# Altium project PROC154E3_SCH.PrjPcb (part 51 of 60)

## Sheet 54. SOC CORE HCPS-B.SchDoc: HCPS B - VDD CORE
size 513 x 386 mm; Project: PROC154E2(001)_SK_AM69; Issue: 1.0; RevCode: E3; Page Create Date: March  8, 1995; Variant Name: Core Design; Schematic Page Number: 54; Page Number: 54; Page Size: C; Comment: MISTRAL_TITLEBLK_CSIZE_1; Page Count: 62; Schematic Page Count: 62; Name: PROC154E2 001 SK AM69; DsnPath: C:\Users\danie\Downloads\sprr466c\PROC154E3_RP\PROC154E3_SCH.DSN; SchematicName: SCHEMATIC1; PageName: 54. SOC CORE HCPS-B; PageSize: C; TopSchematic: True
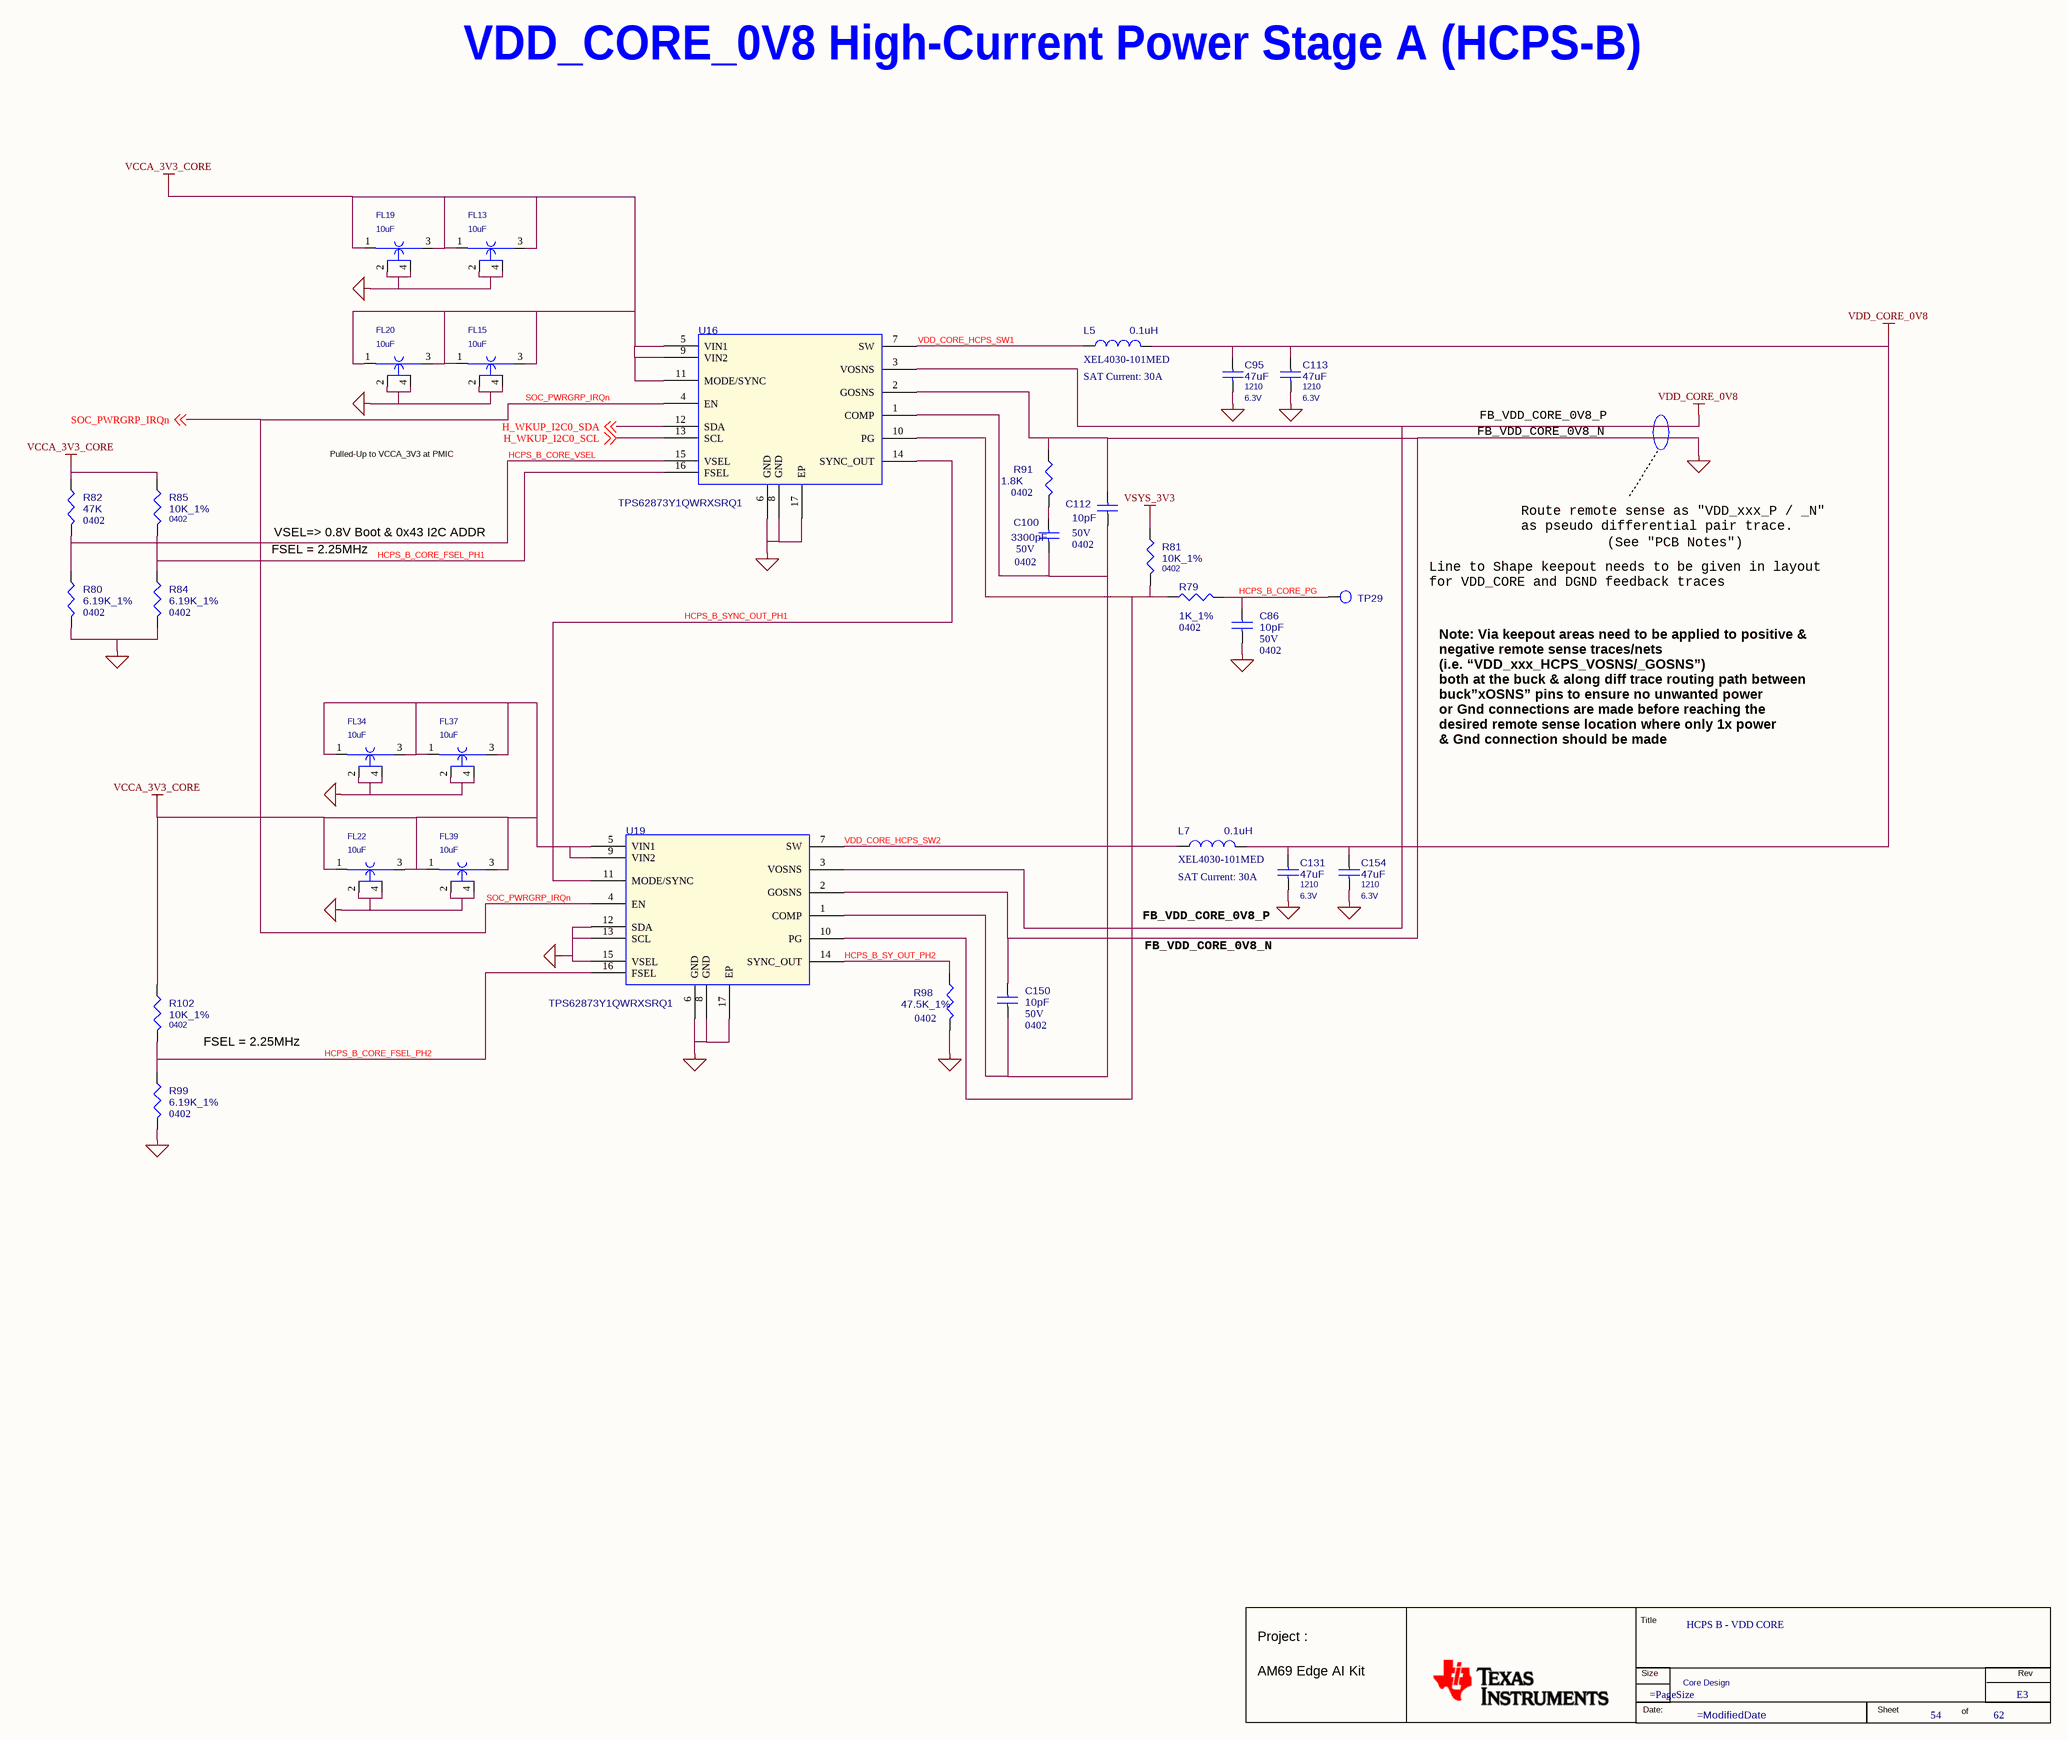
[diagram p91: 54. SOC CORE HCPS-B.SchDoc]

### Parts
(Parts that share a designator on the sheet are numbered #1, #2 ... from top to bottom, then left to right.)
*#54  RevCode: E3  Title: HCPS B - VDD CORE  Page Number: 54  Page Count: 62  Variant Name: Core Design  (hidden comment: MISTRAL_TITLEBLK_CSIZE_1)  (graphical)
C86  10pF  Package: 0402  Voltage: 50V  [CAP0402_0-75]
C95  47uF  Package: 1210  Voltage: 6.3V  [CAP1210_2-75]
C100  3300pF  Package: 0402  Voltage: 50V  [CAP0402_0-75]
C112  10pF  Package: 0402  Voltage: 50V  [CAP0402_0-75]
C113  47uF  Package: 1210  Voltage: 6.3V  [CAP1210_2-75]
C131  47uF  Package: 1210  Voltage: 6.3V  [CAP1210_2-75]
C150  10pF  Package: 0402  Voltage: 50V  [CAP0402_0-75]
C154  47uF  Package: 1210  Voltage: 6.3V  [CAP1210_2-75]
FL13  10uF  [EMIFIL_NFM18C_0603_0-7_TI]
FL15  10uF  [EMIFIL_NFM18C_0603_0-7_TI]
FL19  10uF  [EMIFIL_NFM18C_0603_0-7_TI]
FL20  10uF  [EMIFIL_NFM18C_0603_0-7_TI]
FL22  10uF  [EMIFIL_NFM18C_0603_0-7_TI]
FL34  10uF  [EMIFIL_NFM18C_0603_0-7_TI]
FL37  10uF  [EMIFIL_NFM18C_0603_0-7_TI]
FL39  10uF  [EMIFIL_NFM18C_0603_0-7_TI]
L5  0.1uH  Mfr_part_number: XEL4030-101MED  SAT Current: 30A  [IND_XEL4030_170X170_SMD_3-2]
L7  0.1uH  Mfr_part_number: XEL4030-101MED  SAT Current: 30A  [IND_XEL4030_170X170_SMD_3-2]
R79  1K_1%  Package: 0402  [RES0402_0-5]
R80  6.19K_1%  Package: 0402  [RES0402_0-5]
R81  10K_1%  Package: 0402  [RES0402_0-5]
R82  47K  Package: 0402  [RES0402_0-5]
R84  6.19K_1%  Package: 0402  [RES0402_0-5]
R85  10K_1%  Package: 0402  [RES0402_0-5]
R91  1.8K  Package: 0402  [RES0402_0-5]
R98  47.5K_1%  Package: 0402  [RES0402_0-5]
R99  6.19K_1%  Package: 0402  [RES0402_0-5]
R102  10K_1%  Package: 0402  [RES0402_0-5]
TP29  TP30_SMD  [TP30_SMD]  (value not drawn)
U16  TPS62873Y1QWRXSRQ1  [VQFN16_TPS62872-Q1_100X140_1-1]
U19  TPS62873Y1QWRXSRQ1  [VQFN16_TPS62872-Q1_100X140_1-1]

### Nets
DGND: C86.2 C95.2 C112.1 C113.2 C131.2 C150.1 C154.2 FL13.2 FL13.4 FL15.2 FL15.4 FL19.2 FL19.4 FL20.2 FL20.4 FL22.2 FL22.4 FL34.2 FL34.4 FL37.2 FL37.4 FL39.2 FL39.4 R80.2 R84.2 R91.1 R98.2 R99.2 U16.2(GOSNS) U16.6(GND) U16.8(GND) U16.17(EP) U19.2(GOSNS) U19.6(GND) U19.8(GND) U19.12(SDA) U19.13(SCL) U19.15(VSEL) U19.17(EP)  [project net VDD_CPU_HCPS_GOSNS]
VCCA_3V3_CORE: FL13.1 FL13.3 FL15.1 FL15.3 FL19.1 FL19.3 FL20.1 FL20.3 FL22.1 FL22.3 FL34.1 FL34.3 FL37.1 FL37.3 FL39.1 FL39.3 R82.1 R85.1 R102.1 U16.5(VIN1) U16.9(VIN2) U16.11(MODE/SYNC) U19.5(VIN1) U19.9(VIN2)
VDD_CORE_0V8: C95.1 C113.1 C131.1 C154.1 L5.2 L7.2 U16.3(VOSNS) U19.3(VOSNS)  [project net VDD_WAKE0]
VSYS_3V3: R81.1  [project net V_3V3]
H_WKUP_I2C0_SCL: U16.13(SCL) ; off-sheet H_WKUP_I2C0_SCL
H_WKUP_I2C0_SDA: U16.12(SDA) ; off-sheet H_WKUP_I2C0_SDA
HCPS_B_CORE_FSEL_PH1: R84.1 R85.2 U16.16(FSEL)
HCPS_B_CORE_FSEL_PH2: R99.1 R102.2 U19.16(FSEL)
HCPS_B_CORE_PG: C86.1 R79.2 TP29.1(TP)
HCPS_B_CORE_VSEL: R80.1 R82.2 U16.15(VSEL)
HCPS_B_SY_OUT_PH2: R98.1 U19.14(SYNC_OUT)
HCPS_B_SYNC_OUT_PH1: U16.14(SYNC_OUT) U19.11(MODE/SYNC)
SOC_PWRGRP_IRQn: U16.4(EN) U19.4(EN) ; off-sheet SOC_PWRGRP_IRQn
VDD_CORE_HCPS_SW1: L5.1 U16.7(SW)
VDD_CORE_HCPS_SW2: L7.1 U19.7(SW)
NetC100_1: C100.1 R91.2
NetC100_2: C100.2 C112.2 C150.2 U16.1(COMP) U19.1(COMP)
NetR79_1: R79.1 R81.2 U16.10(PG) U19.10(PG)

### Notes on the sheet
- VDD_CORE_0V8 High-Current Power Stage A (HCPS-B)
- FB_VDD_CORE_0V8_N
- FB_VDD_CORE_0V8_P
- Pulled-Up to VCCA_3V3 at PMIC
- VSEL=> 0.8V Boot & 0x43 I2C ADDR
- Route remote sense as "VDD_xxx_P / _N"
  as pseudo differential pair trace.
- (See "PCB Notes")
- FSEL = 2.25MHz
- Line to Shape keepout needs to be given in layout
  for VDD_CORE and DGND feedback traces
- Note: Via keepout areas need to be applied to positive &
  negative remote sense traces/nets
  (i.e. “VDD_xxx_HCPS_VOSNS/_GOSNS”)
  both at the buck & along diff trace routing path between
  buck”xOSNS” pins to ensure no unwanted power
  or Gnd connections are made before reaching the
  desired remote sense location where only 1x power
  & Gnd connection should be made
- (in symbol MISTRAL_TITLEBLK_CSIZE_1) Title; Project :; Size; Rev; AM69 Edge AI Kit; Date:; Sheet; of

### Library data of the parts
*#54 = MISTRAL_TITLEBLK_CSIZE_1: Issue: 1.0; Project: PROC154E2(001)_SK_AM69; Name: PROC154E2 001 SK AM69; Page Create Date: March  8, 1995; Page Size: =PageSize; Page Modify Date: =ModifiedDate; Schematic Page Count: 62; Schematic Page Number: 54
C86 = CAP_Dup1: CAP CERAMIC 10pF 50V 1% C0G(NP0) 0402; Part Reference: C86; Automotive Alternate_mfr_part_number: CGA2B1X7R1C104K050BC; Automotive Alternate_mfr_name: TDK; Direct Alternate_mfr_part_number: GCM155R71C104JA55D; Direct Alternate_mfr_name: MURATA; Part_type: CAPACITORS\CERAMIC; Mfr_part_number: 04025U100FAT2A; Mfr_name: AVX CORPORATION; Mistral Part No: 120014060010-R; Custom_Duty: 15%; Customs_HS_Code: 85322990; Wattage: NA; Project: AEGIS_POM; Value: 10pF; Footprint Path: Y:\MIS_DATABASE\Library\ALTIUM_TOOL\PCB_FOOTPRINTS\Altium_Footprint_Lib.PcbLib; Library Path: Y:\MIS_DATABASE\Library\ALTIUM_TOOL\SCHEMATICS_PARTS\MS_DISCRETE_Library.schlib; MECHANICAL 3D STEP FILE: CAP0402_0-75; Chkd/date: VASANTHA/200614; Crtd /date: NAVEED/170614; Datasheet: Y:\MIS_DATABASE\DATASHEETS\CAPACITORS\AVX_MLC.PDF; Temperature: -55°C+125°C; Weight: 0.65mg; Height: 0.55MM; Library Ref: CAP; Distributor_part_number: 478-5717-1-ND; Distributor_name: DIGIKEY; Tolerance: 1%; Footprint Ref: CAP0402_0-75; Manufacturer: AVX CORPORATION; PCB Footprint: CAP0402_0-75
C95 = CAP_Dup1: CAP CERAMIC 47uF 6.3V 10% X7R AUTO 1210; Part Reference: C95; Automotive Alternate_mfr_part_number: CGA6P1X7S1A476M; Automotive Alternate_mfr_name: TDK; Part_type: CAPACITORS\CERAMIC; Mfr_part_number: GCM32ER70J476KE19L; Mfr_name: MURATA; Mistral Part No: 120018090056-R; Custom_Duty: 15%; Customs_HS_Code: 85322990; Wattage: NA; Project: TI_J7_SVB-DUT; Value: 47uF; Direct Alternate_mfr_part_number: CGA6P1X7S1A476M; Direct Alternate_mfr_name: TDK; Footprint Path: Y:\MIS_DATABASE\Library\ALTIUM_TOOL\PCB_FOOTPRINTS\Altium_Footprint_Lib.PcbLib; Library Path: Y:\MIS_DATABASE\Library\ALTIUM_TOOL\SCHEMATICS_PARTS\MS_DISCRETE_Library.schlib; MECHANICAL 3D STEP FILE: CAP1210_2-75; Chkd/date: MANIRAJA/280918; Crtd /date: ALVY/280918; Datasheet: Y:\MIS_DATABASE\DATASHEETS\CAPACITORS\MURATA-GCM-SER.PDF; Temperature: -55°C+125°C; Weight: 110mg; Height: 2.70MM; Library Ref: CAP; Distributor_part_number: 490-4844-1-ND; Distributor_name: DIGIKEY; Tolerance: 10%; Footprint Ref: CAP1210_2-75; Manufacturer: MURATA; PCB Footprint: CAP1210_2-75
C100 = CAP_Dup1: CAP CERAMIC 3300pF 50V 10% X7R 0402; Part Reference: C100; Automotive Alternate_mfr_part_number: CGA2B1X7R1C104K050BC; Automotive Alternate_mfr_name: TDK; Direct Alternate_mfr_part_number: GCM155R71C104JA55D; Direct Alternate_mfr_name: MURATA; Part_type: CAPACITORS\CERAMIC; Mfr_part_number: GCM155R71H332KA37D; Mistral Part No: 120022080077-R; Custom_Duty: 15%; Customs_HS_Code: 85322990; Wattage: NA; Project: BRUKER_SD820_COMMONDO; Value: 3300pF; Footprint Path: Y:\MIS_DATABASE\Library\ALTIUM_TOOL\PCB_FOOTPRINTS\Altium_Footprint_Lib.PcbLib; Library Path: Y:\MIS_DATABASE\Library\ALTIUM_TOOL\SCHEMATICS_PARTS\MS_DISCRETE_Library.schlib; MECHANICAL 3D STEP FILE: CAP0402_0-75; Chkd/date: PRAVEEN/300822; Crtd /date: PRAVEEN/300822; Datasheet: Y:\MIS_DATABASE\DATASHEETS\CAPACITORS\GCM155R71H332KA37D.PDF; Temperature: -55°C+125°C; Weight: 1.6mg; Height: 0.55MM; Library Ref: CAP; Distributor_part_number: 490-8001-1-ND; Distributor_name: DIGIKEY; Tolerance: 10%; Mfr_name: MURATA; Footprint Ref: CAP0402_0-75; Manufacturer: MURATA; PCB Footprint: CAP0402_0-75
C112 = CAP_Dup1: CAP CERAMIC 10pF 50V 1% C0G(NP0) 0402; Part Reference: C112; Automotive Alternate_mfr_part_number: CGA2B1X7R1C104K050BC; Automotive Alternate_mfr_name: TDK; Direct Alternate_mfr_part_number: GCM155R71C104JA55D; Direct Alternate_mfr_name: MURATA; Part_type: CAPACITORS\CERAMIC; Mfr_part_number: 04025U100FAT2A; Mfr_name: AVX CORPORATION; Mistral Part No: 120014060010-R; Custom_Duty: 15%; Customs_HS_Code: 85322990; Wattage: NA; Project: AEGIS_POM; Value: 10pF; Footprint Path: Y:\MIS_DATABASE\Library\ALTIUM_TOOL\PCB_FOOTPRINTS\Altium_Footprint_Lib.PcbLib; Library Path: Y:\MIS_DATABASE\Library\ALTIUM_TOOL\SCHEMATICS_PARTS\MS_DISCRETE_Library.schlib; MECHANICAL 3D STEP FILE: CAP0402_0-75; Chkd/date: VASANTHA/200614; Crtd /date: NAVEED/170614; Datasheet: Y:\MIS_DATABASE\DATASHEETS\CAPACITORS\AVX_MLC.PDF; Temperature: -55°C+125°C; Weight: 0.65mg; Height: 0.55MM; Library Ref: CAP; Distributor_part_number: 478-5717-1-ND; Distributor_name: DIGIKEY; Tolerance: 1%; Footprint Ref: CAP0402_0-75; Manufacturer: AVX CORPORATION; PCB Footprint: CAP0402_0-75
C113 = CAP_Dup1: CAP CERAMIC 47uF 6.3V 10% X7R AUTO 1210; Part Reference: C113; Automotive Alternate_mfr_part_number: CGA6P1X7S1A476M; Automotive Alternate_mfr_name: TDK; Part_type: CAPACITORS\CERAMIC; Mfr_part_number: GCM32ER70J476KE19L; Mfr_name: MURATA; Mistral Part No: 120018090056-R; Custom_Duty: 15%; Customs_HS_Code: 85322990; Wattage: NA; Project: TI_J7_SVB-DUT; Value: 47uF; Direct Alternate_mfr_part_number: CGA6P1X7S1A476M; Direct Alternate_mfr_name: TDK; Footprint Path: Y:\MIS_DATABASE\Library\ALTIUM_TOOL\PCB_FOOTPRINTS\Altium_Footprint_Lib.PcbLib; Library Path: Y:\MIS_DATABASE\Library\ALTIUM_TOOL\SCHEMATICS_PARTS\MS_DISCRETE_Library.schlib; MECHANICAL 3D STEP FILE: CAP1210_2-75; Chkd/date: MANIRAJA/280918; Crtd /date: ALVY/280918; Datasheet: Y:\MIS_DATABASE\DATASHEETS\CAPACITORS\MURATA-GCM-SER.PDF; Temperature: -55°C+125°C; Weight: 110mg; Height: 2.70MM; Library Ref: CAP; Distributor_part_number: 490-4844-1-ND; Distributor_name: DIGIKEY; Tolerance: 10%; Footprint Ref: CAP1210_2-75; Manufacturer: MURATA; PCB Footprint: CAP1210_2-75
C131 = CAP_Dup1: CAP CERAMIC 47uF 6.3V 10% X7R AUTO 1210; Part Reference: C131; Automotive Alternate_mfr_part_number: CGA6P1X7S1A476M; Automotive Alternate_mfr_name: TDK; Part_type: CAPACITORS\CERAMIC; Mfr_part_number: GCM32ER70J476KE19L; Mfr_name: MURATA; Mistral Part No: 120018090056-R; Custom_Duty: 15%; Customs_HS_Code: 85322990; Wattage: NA; Project: TI_J7_SVB-DUT; Value: 47uF; Direct Alternate_mfr_part_number: CGA6P1X7S1A476M; Direct Alternate_mfr_name: TDK; Footprint Path: Y:\MIS_DATABASE\Library\ALTIUM_TOOL\PCB_FOOTPRINTS\Altium_Footprint_Lib.PcbLib; Library Path: Y:\MIS_DATABASE\Library\ALTIUM_TOOL\SCHEMATICS_PARTS\MS_DISCRETE_Library.schlib; MECHANICAL 3D STEP FILE: CAP1210_2-75; Chkd/date: MANIRAJA/280918; Crtd /date: ALVY/280918; Datasheet: Y:\MIS_DATABASE\DATASHEETS\CAPACITORS\MURATA-GCM-SER.PDF; Temperature: -55°C+125°C; Weight: 110mg; Height: 2.70MM; Library Ref: CAP; Distributor_part_number: 490-4844-1-ND; Distributor_name: DIGIKEY; Tolerance: 10%; Footprint Ref: CAP1210_2-75; Manufacturer: MURATA; PCB Footprint: CAP1210_2-75
C150 = CAP_Dup1: CAP CERAMIC 10pF 50V 1% C0G(NP0) 0402; Part Reference: C150; Automotive Alternate_mfr_part_number: CGA2B1X7R1C104K050BC; Automotive Alternate_mfr_name: TDK; Direct Alternate_mfr_part_number: GCM155R71C104JA55D; Direct Alternate_mfr_name: MURATA; Part_type: CAPACITORS\CERAMIC; Mfr_part_number: 04025U100FAT2A; Mfr_name: AVX CORPORATION; Mistral Part No: 120014060010-R; Custom_Duty: 15%; Customs_HS_Code: 85322990; Wattage: NA; Project: AEGIS_POM; Value: 10pF; Footprint Path: Y:\MIS_DATABASE\Library\ALTIUM_TOOL\PCB_FOOTPRINTS\Altium_Footprint_Lib.PcbLib; Library Path: Y:\MIS_DATABASE\Library\ALTIUM_TOOL\SCHEMATICS_PARTS\MS_DISCRETE_Library.schlib; MECHANICAL 3D STEP FILE: CAP0402_0-75; Chkd/date: VASANTHA/200614; Crtd /date: NAVEED/170614; Datasheet: Y:\MIS_DATABASE\DATASHEETS\CAPACITORS\AVX_MLC.PDF; Temperature: -55°C+125°C; Weight: 0.65mg; Height: 0.55MM; Library Ref: CAP; Distributor_part_number: 478-5717-1-ND; Distributor_name: DIGIKEY; Tolerance: 1%; Footprint Ref: CAP0402_0-75; Manufacturer: AVX CORPORATION; PCB Footprint: CAP0402_0-75
C154 = CAP_Dup1: CAP CERAMIC 47uF 6.3V 10% X7R AUTO 1210; Part Reference: C154; Automotive Alternate_mfr_part_number: CGA6P1X7S1A476M; Automotive Alternate_mfr_name: TDK; Part_type: CAPACITORS\CERAMIC; Mfr_part_number: GCM32ER70J476KE19L; Mfr_name: MURATA; Mistral Part No: 120018090056-R; Custom_Duty: 15%; Customs_HS_Code: 85322990; Wattage: NA; Project: TI_J7_SVB-DUT; Value: 47uF; Direct Alternate_mfr_part_number: CGA6P1X7S1A476M; Direct Alternate_mfr_name: TDK; Footprint Path: Y:\MIS_DATABASE\Library\ALTIUM_TOOL\PCB_FOOTPRINTS\Altium_Footprint_Lib.PcbLib; Library Path: Y:\MIS_DATABASE\Library\ALTIUM_TOOL\SCHEMATICS_PARTS\MS_DISCRETE_Library.schlib; MECHANICAL 3D STEP FILE: CAP1210_2-75; Chkd/date: MANIRAJA/280918; Crtd /date: ALVY/280918; Datasheet: Y:\MIS_DATABASE\DATASHEETS\CAPACITORS\MURATA-GCM-SER.PDF; Temperature: -55°C+125°C; Weight: 110mg; Height: 2.70MM; Library Ref: CAP; Distributor_part_number: 490-4844-1-ND; Distributor_name: DIGIKEY; Tolerance: 10%; Footprint Ref: CAP1210_2-75; Manufacturer: MURATA; PCB Footprint: CAP1210_2-75
FL13 = CAP_NFM_TI: PASSIVE FILTER EMI 10uF 4V AUTO 0603; Part Reference: FL13; Mfr_part_number: NFM18HC106D0G_TI; Mfr_name: MURATA; Mistral Part No: 130018100049; Custom_Duty: 15%; Customs_HS_Code: 85412900; Wattage: NA; Project: TI_J7ES_EVM_SOM; Value: 10uF; Footprint Path: Y:\MIS_DATABASE\Library\ALTIUM_TOOL\PCB_FOOTPRINTS\Altium_Footprint_Lib.PcbLib; Library Path: Y:\MIS_DATABASE\Library\ALTIUM_TOOL\SCHEMATICS_PARTS\MS_FILTER_Library.schlib; MECHANICAL 3D STEP FILE: EMIFIL_NFM18C_0603_0-7_TI; RoHS: NA; Chkd/date: MANIRAJA/251018; Crtd /date: ALVY/251018; Datasheet: Y:\MIS_DATABASE\DATASHEETS\DISCRETES\INDUCTORS\NFM18HC-SER.PDF; Temperature: NA; Weight: NA; Height: 0.70MM; PCB Footprint: EMIFIL_NFM18C_0603_0-7_TI; Library Ref: CAP_NFM_TI; Distributor_part_number: NA; Distributor_name: NA; Package: 0603; Voltage: 4V; Tolerance: NA; Part_type: FILTER; Footprint Ref: EMIFIL_NFM18C_0603_0-7_TI
FL15 = CAP_NFM_TI: PASSIVE FILTER EMI 10uF 4V AUTO 0603; Part Reference: FL15; Mfr_part_number: NFM18HC106D0G_TI; Mfr_name: MURATA; Mistral Part No: 130018100049; Custom_Duty: 15%; Customs_HS_Code: 85412900; Wattage: NA; Project: TI_J7ES_EVM_SOM; Value: 10uF; Footprint Path: Y:\MIS_DATABASE\Library\ALTIUM_TOOL\PCB_FOOTPRINTS\Altium_Footprint_Lib.PcbLib; Library Path: Y:\MIS_DATABASE\Library\ALTIUM_TOOL\SCHEMATICS_PARTS\MS_FILTER_Library.schlib; MECHANICAL 3D STEP FILE: EMIFIL_NFM18C_0603_0-7_TI; RoHS: NA; Chkd/date: MANIRAJA/251018; Crtd /date: ALVY/251018; Datasheet: Y:\MIS_DATABASE\DATASHEETS\DISCRETES\INDUCTORS\NFM18HC-SER.PDF; Temperature: NA; Weight: NA; Height: 0.70MM; PCB Footprint: EMIFIL_NFM18C_0603_0-7_TI; Library Ref: CAP_NFM_TI; Distributor_part_number: NA; Distributor_name: NA; Package: 0603; Voltage: 4V; Tolerance: NA; Part_type: FILTER; Footprint Ref: EMIFIL_NFM18C_0603_0-7_TI
FL19 = CAP_NFM_TI: PASSIVE FILTER EMI 10uF 4V AUTO 0603; Part Reference: FL19; Mfr_part_number: NFM18HC106D0G_TI; Mfr_name: MURATA; Mistral Part No: 130018100049; Custom_Duty: 15%; Customs_HS_Code: 85412900; Wattage: NA; Project: TI_J7ES_EVM_SOM; Value: 10uF; Footprint Path: Y:\MIS_DATABASE\Library\ALTIUM_TOOL\PCB_FOOTPRINTS\Altium_Footprint_Lib.PcbLib; Library Path: Y:\MIS_DATABASE\Library\ALTIUM_TOOL\SCHEMATICS_PARTS\MS_FILTER_Library.schlib; MECHANICAL 3D STEP FILE: EMIFIL_NFM18C_0603_0-7_TI; RoHS: NA; Chkd/date: MANIRAJA/251018; Crtd /date: ALVY/251018; Datasheet: Y:\MIS_DATABASE\DATASHEETS\DISCRETES\INDUCTORS\NFM18HC-SER.PDF; Temperature: NA; Weight: NA; Height: 0.70MM; PCB Footprint: EMIFIL_NFM18C_0603_0-7_TI; Library Ref: CAP_NFM_TI; Distributor_part_number: NA; Distributor_name: NA; Package: 0603; Voltage: 4V; Tolerance: NA; Part_type: FILTER; Footprint Ref: EMIFIL_NFM18C_0603_0-7_TI
FL20 = CAP_NFM_TI: PASSIVE FILTER EMI 10uF 4V AUTO 0603; Part Reference: FL20; Mfr_part_number: NFM18HC106D0G_TI; Mfr_name: MURATA; Mistral Part No: 130018100049; Custom_Duty: 15%; Customs_HS_Code: 85412900; Wattage: NA; Project: TI_J7ES_EVM_SOM; Value: 10uF; Footprint Path: Y:\MIS_DATABASE\Library\ALTIUM_TOOL\PCB_FOOTPRINTS\Altium_Footprint_Lib.PcbLib; Library Path: Y:\MIS_DATABASE\Library\ALTIUM_TOOL\SCHEMATICS_PARTS\MS_FILTER_Library.schlib; MECHANICAL 3D STEP FILE: EMIFIL_NFM18C_0603_0-7_TI; RoHS: NA; Chkd/date: MANIRAJA/251018; Crtd /date: ALVY/251018; Datasheet: Y:\MIS_DATABASE\DATASHEETS\DISCRETES\INDUCTORS\NFM18HC-SER.PDF; Temperature: NA; Weight: NA; Height: 0.70MM; PCB Footprint: EMIFIL_NFM18C_0603_0-7_TI; Library Ref: CAP_NFM_TI; Distributor_part_number: NA; Distributor_name: NA; Package: 0603; Voltage: 4V; Tolerance: NA; Part_type: FILTER; Footprint Ref: EMIFIL_NFM18C_0603_0-7_TI
FL22 = CAP_NFM_TI: PASSIVE FILTER EMI 10uF 4V AUTO 0603; Part Reference: FL22; Mfr_part_number: NFM18HC106D0G_TI; Mfr_name: MURATA; Mistral Part No: 130018100049; Custom_Duty: 15%; Customs_HS_Code: 85412900; Wattage: NA; Project: TI_J7ES_EVM_SOM; Value: 10uF; Footprint Path: Y:\MIS_DATABASE\Library\ALTIUM_TOOL\PCB_FOOTPRINTS\Altium_Footprint_Lib.PcbLib; Library Path: Y:\MIS_DATABASE\Library\ALTIUM_TOOL\SCHEMATICS_PARTS\MS_FILTER_Library.schlib; MECHANICAL 3D STEP FILE: EMIFIL_NFM18C_0603_0-7_TI; RoHS: NA; Chkd/date: MANIRAJA/251018; Crtd /date: ALVY/251018; Datasheet: Y:\MIS_DATABASE\DATASHEETS\DISCRETES\INDUCTORS\NFM18HC-SER.PDF; Temperature: NA; Weight: NA; Height: 0.70MM; PCB Footprint: EMIFIL_NFM18C_0603_0-7_TI; Library Ref: CAP_NFM_TI; Distributor_part_number: NA; Distributor_name: NA; Package: 0603; Voltage: 4V; Tolerance: NA; Part_type: FILTER; Footprint Ref: EMIFIL_NFM18C_0603_0-7_TI
FL34 = CAP_NFM_TI: PASSIVE FILTER EMI 10uF 4V AUTO 0603; Part Reference: FL34; Mfr_part_number: NFM18HC106D0G_TI; Mfr_name: MURATA; Mistral Part No: 130018100049; Custom_Duty: 15%; Customs_HS_Code: 85412900; Wattage: NA; Project: TI_J7ES_EVM_SOM; Value: 10uF; Footprint Path: Y:\MIS_DATABASE\Library\ALTIUM_TOOL\PCB_FOOTPRINTS\Altium_Footprint_Lib.PcbLib; Library Path: Y:\MIS_DATABASE\Library\ALTIUM_TOOL\SCHEMATICS_PARTS\MS_FILTER_Library.schlib; MECHANICAL 3D STEP FILE: EMIFIL_NFM18C_0603_0-7_TI; RoHS: NA; Chkd/date: MANIRAJA/251018; Crtd /date: ALVY/251018; Datasheet: Y:\MIS_DATABASE\DATASHEETS\DISCRETES\INDUCTORS\NFM18HC-SER.PDF; Temperature: NA; Weight: NA; Height: 0.70MM; PCB Footprint: EMIFIL_NFM18C_0603_0-7_TI; Library Ref: CAP_NFM_TI; Distributor_part_number: NA; Distributor_name: NA; Package: 0603; Voltage: 4V; Tolerance: NA; Part_type: FILTER; Footprint Ref: EMIFIL_NFM18C_0603_0-7_TI
FL37 = CAP_NFM_TI: PASSIVE FILTER EMI 10uF 4V AUTO 0603; Part Reference: FL37; Mfr_part_number: NFM18HC106D0G_TI; Mfr_name: MURATA; Mistral Part No: 130018100049; Custom_Duty: 15%; Customs_HS_Code: 85412900; Wattage: NA; Project: TI_J7ES_EVM_SOM; Value: 10uF; Footprint Path: Y:\MIS_DATABASE\Library\ALTIUM_TOOL\PCB_FOOTPRINTS\Altium_Footprint_Lib.PcbLib; Library Path: Y:\MIS_DATABASE\Library\ALTIUM_TOOL\SCHEMATICS_PARTS\MS_FILTER_Library.schlib; MECHANICAL 3D STEP FILE: EMIFIL_NFM18C_0603_0-7_TI; RoHS: NA; Chkd/date: MANIRAJA/251018; Crtd /date: ALVY/251018; Datasheet: Y:\MIS_DATABASE\DATASHEETS\DISCRETES\INDUCTORS\NFM18HC-SER.PDF; Temperature: NA; Weight: NA; Height: 0.70MM; PCB Footprint: EMIFIL_NFM18C_0603_0-7_TI; Library Ref: CAP_NFM_TI; Distributor_part_number: NA; Distributor_name: NA; Package: 0603; Voltage: 4V; Tolerance: NA; Part_type: FILTER; Footprint Ref: EMIFIL_NFM18C_0603_0-7_TI
FL39 = CAP_NFM_TI: PASSIVE FILTER EMI 10uF 4V AUTO 0603; Part Reference: FL39; Mfr_part_number: NFM18HC106D0G_TI; Mfr_name: MURATA; Mistral Part No: 130018100049; Custom_Duty: 15%; Customs_HS_Code: 85412900; Wattage: NA; Project: TI_J7ES_EVM_SOM; Value: 10uF; Footprint Path: Y:\MIS_DATABASE\Library\ALTIUM_TOOL\PCB_FOOTPRINTS\Altium_Footprint_Lib.PcbLib; Library Path: Y:\MIS_DATABASE\Library\ALTIUM_TOOL\SCHEMATICS_PARTS\MS_FILTER_Library.schlib; MECHANICAL 3D STEP FILE: EMIFIL_NFM18C_0603_0-7_TI; RoHS: NA; Chkd/date: MANIRAJA/251018; Crtd /date: ALVY/251018; Datasheet: Y:\MIS_DATABASE\DATASHEETS\DISCRETES\INDUCTORS\NFM18HC-SER.PDF; Temperature: NA; Weight: NA; Height: 0.70MM; PCB Footprint: EMIFIL_NFM18C_0603_0-7_TI; Library Ref: CAP_NFM_TI; Distributor_part_number: NA; Distributor_name: NA; Package: 0603; Voltage: 4V; Tolerance: NA; Part_type: FILTER; Footprint Ref: EMIFIL_NFM18C_0603_0-7_TI
L5 = INDUCTOR: IND POWER 0.1uH 25.8A 20% SMD; Part Reference: L5; Part #: 105324-1470R; Mfr_name: COILCRAFT; Mistral Part No: 130022010018-R; Custom_Duty: 24%; Customs_HS_Code: 85437099; Wattage: NA; Project: J7AHP_PROTO_BRD; Value: 0.1uH; Footprint Path: Y:\MIS_DATABASE\Library\ALTIUM_TOOL\PCB_FOOTPRINTS\Altium_Footprint_Lib.PcbLib; Library Path: Y:\MIS_DATABASE\Library\ALTIUM_TOOL\SCHEMATICS_PARTS\MS_DISCRETE_Library.schlib; MECHANICAL 3D STEP FILE: IND_XEL4030_170X170_SMD_3-2; Chkd/date: MANIRAJA/170122; Crtd /date: TAMILARASU/170122; Datasheet: Y:\MIS_DATABASE\DATASHEETS\DISCRETES\INDUCTORS\XEL4030_JUN20.PDF; Temperature: -40°C+125°C; Weight: 280mg; Height: 3.20MM; Library Ref: INDUCTOR; Distributor_part_number: 994-XEL4030-101MED; Distributor_name: MOUSER; Package: SMD; Voltage: NA; Tolerance: 20%; Part_type: INDUCTOR; Footprint Ref: IND_XEL4030_170X170_SMD_3-2; Manufacturer: COILCRAFT; PCB Footprint: IND_XEL4030_170X170_SMD_3-2
L7 = INDUCTOR: IND POWER 0.1uH 25.8A 20% SMD; Part Reference: L7; Part #: 105324-1470R; Mfr_name: COILCRAFT; Mistral Part No: 130022010018-R; Custom_Duty: 24%; Customs_HS_Code: 85437099; Wattage: NA; Project: J7AHP_PROTO_BRD; Value: 0.1uH; Footprint Path: Y:\MIS_DATABASE\Library\ALTIUM_TOOL\PCB_FOOTPRINTS\Altium_Footprint_Lib.PcbLib; Library Path: Y:\MIS_DATABASE\Library\ALTIUM_TOOL\SCHEMATICS_PARTS\MS_DISCRETE_Library.schlib; MECHANICAL 3D STEP FILE: IND_XEL4030_170X170_SMD_3-2; Chkd/date: MANIRAJA/170122; Crtd /date: TAMILARASU/170122; Datasheet: Y:\MIS_DATABASE\DATASHEETS\DISCRETES\INDUCTORS\XEL4030_JUN20.PDF; Temperature: -40°C+125°C; Weight: 280mg; Height: 3.20MM; Library Ref: INDUCTOR; Distributor_part_number: 994-XEL4030-101MED; Distributor_name: MOUSER; Package: SMD; Voltage: NA; Tolerance: 20%; Part_type: INDUCTOR; Footprint Ref: IND_XEL4030_170X170_SMD_3-2; Manufacturer: COILCRAFT; PCB Footprint: IND_XEL4030_170X170_SMD_3-2
R79 = RESISTOR_Dup2: RES 1K 1/10W 1% 0402; Part Reference: R79; Mistral Part No: 110009030411-R; Mfr_name: PANASONIC-ECG; Mfr_part_number: ERJ-2RKF1001X; Part_type: RESISTORS\FIXED; Project: VOCERA; Voltage: NA; Customs_HS_Code: 85332119; Custom_Duty: 15%; Value: 1K_1%; Footprint Ref: RES0402_0-5; Tolerance: 1%; Wattage: 1/10W; Distributor_name: DIGIKEY; Distributor_part_number: P1.00KLCT-ND; Library Ref: RESISTOR; Height: 0.40MM; Weight: 0.8mg; Temperature: -55°C+155°C; Datasheet: Y:\MIS_DATABASE\DATASHEETS\RESISTORS\PAN-ERJSER_NOV17.PDF; Crtd /date: MAZHAR/150506; Chkd/date: VASANTHA/281216; MECHANICAL 3D STEP FILE: RES0402_0-5; Library Path: Y:\MIS_DATABASE\Library\ALTIUM_TOOL\SCHEMATICS_PARTS\MS_DISCRETE_Library.schlib; Footprint Path: Y:\MIS_DATABASE\Library\ALTIUM_TOOL\PCB_FOOTPRINTS\Altium_Footprint_Lib.PcbLib; Manufacturer: PANASONIC-ECG; PCB Footprint: RES0402_0-5
R80 = RESISTOR_Dup2: RES 6.19K 1/16W 1% 0402; Part Reference: R80; Part_type: RESISTORS\FIXED; Mfr_part_number: RC0402FR-076K19L; Mfr_name: YAGEO AMERICA; Mistral Part No: 110022010013-R; Custom_Duty: 15%; Customs_HS_Code: 85332119; Voltage: NA; Project: J7AHP_PROTO_BRD; Value: 6.19K_1%; Footprint Path: Y:\MIS_DATABASE\Library\ALTIUM_TOOL\PCB_FOOTPRINTS\Altium_Footprint_Lib.PcbLib; Library Path: Y:\MIS_DATABASE\Library\ALTIUM_TOOL\SCHEMATICS_PARTS\MS_DISCRETE_Library.schlib; MECHANICAL 3D STEP FILE: RES0402_0-5; Chkd/date: MANIRAJA/190122; Crtd /date: TAMILARASU/190122; Datasheet: Y:\MIS_DATABASE\DATASHEETS\RESISTORS\RCXXXXL-SER_MAR18.PDF; Temperature: -55°C+155°C; Weight: 0.65mg; Height: 0.40MM; Library Ref: RESISTOR; Distributor_part_number: 311-6.19KLRCT-ND; Distributor_name: DIGIKEY; Wattage: 1/16W; Tolerance: 1%; Footprint Ref: RES0402_0-5; Manufacturer: YAGEO AMERICA; PCB Footprint: RES0402_0-5
R81 = RESISTOR_Dup2: RES 10K 1/16W 1% 0402; Part Reference: R81; Part_type: RESISTORS\FIXED; Mfr_part_number: RC0402FR-0710KL; Mfr_name: YAGEO AMERICA; Mistral Part No: 110015090015-R; Custom_Duty: 15%; Customs_HS_Code: 85332119; Voltage: NA; Project: VOCERA; Value: 10K_1%; Footprint Path: Y:\MIS_DATABASE\Library\ALTIUM_TOOL\PCB_FOOTPRINTS\Altium_Footprint_Lib.PcbLib; Library Path: Y:\MIS_DATABASE\Library\ALTIUM_TOOL\SCHEMATICS_PARTS\MS_DISCRETE_Library.schlib; MECHANICAL 3D STEP FILE: RES0402_0-5; Chkd/date: VASANTHA/201216; Crtd /date: GEETHA/290506; Datasheet: Y:\MIS_DATABASE\DATASHEETS\RESISTORS\RCXXXXL-SER_MAR18.PDF; Temperature: -55°C+155°C; Weight: 0.65mg; Height: 0.40MM; Library Ref: RESISTOR; Distributor_part_number: 311-10.0KLRTR-ND; Distributor_name: DIGIKEY; Wattage: 1/16W; Tolerance: 1%; Footprint Ref: RES0402_0-5; Manufacturer: YAGEO AMERICA; PCB Footprint: RES0402_0-5
R82 = RESISTOR_Dup2: RES 47K 1/10W 5% 0402; Part Reference: R82; Part_type: RESISTORS\FIXED; Mfr_part_number: ERJ-2GEJ473X; Mfr_name: PANASONIC-ECG; Mistral Part No: 110009030882-R; Custom_Duty: 15%; Customs_HS_Code: 85332119; Voltage: NA; Project: CTP02_REVA_BASE; Value: 47K; Footprint Path: Y:\MIS_DATABASE\Library\ALTIUM_TOOL\PCB_FOOTPRINTS\Altium_Footprint_Lib.PcbLib; Library Path: Y:\MIS_DATABASE\Library\ALTIUM_TOOL\SCHEMATICS_PARTS\MS_DISCRETE_Library.schlib; MECHANICAL 3D STEP FILE: RES0402_0-5; Chkd/date: VASANTHA/281216; Crtd /date: MAZHAR/120505; Datasheet: Y:\MIS_DATABASE\DATASHEETS\RESISTORS\PAN-ERJSER_NOV17.PDF; Temperature: -55°C+155°C; Weight: 0.8mg; Height: 0.40MM; Library Ref: RESISTOR; Distributor_part_number: P47KJCT-ND; Distributor_name: DIGIKEY; Wattage: 1/10W; Tolerance: 5%; Footprint Ref: RES0402_0-5; Manufacturer: PANASONIC-ECG; PCB Footprint: RES0402_0-5
R84 = RESISTOR_Dup2: RES 6.19K 1/16W 1% 0402; Part Reference: R84; Part_type: RESISTORS\FIXED; Mfr_part_number: RC0402FR-076K19L; Mfr_name: YAGEO AMERICA; Mistral Part No: 110022010013-R; Custom_Duty: 15%; Customs_HS_Code: 85332119; Voltage: NA; Project: J7AHP_PROTO_BRD; Value: 6.19K_1%; Footprint Path: Y:\MIS_DATABASE\Library\ALTIUM_TOOL\PCB_FOOTPRINTS\Altium_Footprint_Lib.PcbLib; Library Path: Y:\MIS_DATABASE\Library\ALTIUM_TOOL\SCHEMATICS_PARTS\MS_DISCRETE_Library.schlib; MECHANICAL 3D STEP FILE: RES0402_0-5; Chkd/date: MANIRAJA/190122; Crtd /date: TAMILARASU/190122; Datasheet: Y:\MIS_DATABASE\DATASHEETS\RESISTORS\RCXXXXL-SER_MAR18.PDF; Temperature: -55°C+155°C; Weight: 0.65mg; Height: 0.40MM; Library Ref: RESISTOR; Distributor_part_number: 311-6.19KLRCT-ND; Distributor_name: DIGIKEY; Wattage: 1/16W; Tolerance: 1%; Footprint Ref: RES0402_0-5; Manufacturer: YAGEO AMERICA; PCB Footprint: RES0402_0-5
R85 = RESISTOR_Dup2: RES 10K 1/16W 1% 0402; Part Reference: R85; Part_type: RESISTORS\FIXED; Mfr_part_number: RC0402FR-0710KL; Mfr_name: YAGEO AMERICA; Mistral Part No: 110015090015-R; Custom_Duty: 15%; Customs_HS_Code: 85332119; Voltage: NA; Project: VOCERA; Value: 10K_1%; Footprint Path: Y:\MIS_DATABASE\Library\ALTIUM_TOOL\PCB_FOOTPRINTS\Altium_Footprint_Lib.PcbLib; Library Path: Y:\MIS_DATABASE\Library\ALTIUM_TOOL\SCHEMATICS_PARTS\MS_DISCRETE_Library.schlib; MECHANICAL 3D STEP FILE: RES0402_0-5; Chkd/date: VASANTHA/201216; Crtd /date: GEETHA/290506; Datasheet: Y:\MIS_DATABASE\DATASHEETS\RESISTORS\RCXXXXL-SER_MAR18.PDF; Temperature: -55°C+155°C; Weight: 0.65mg; Height: 0.40MM; Library Ref: RESISTOR; Distributor_part_number: 311-10.0KLRTR-ND; Distributor_name: DIGIKEY; Wattage: 1/16W; Tolerance: 1%; Footprint Ref: RES0402_0-5; Manufacturer: YAGEO AMERICA; PCB Footprint: RES0402_0-5
R91 = RESISTOR_Dup2: RES 1.8K 1/16W 5% AUTO 0402; Part Reference: R91; Part_type: RESISTORS\FIXED; Mfr_part_number: RC0402JR-071K8L; Mfr_name: YAGEO; Mistral Part No: 110009030147-R; Custom_Duty: 15%; Customs_HS_Code: 85332119; Voltage: NA; Project: MARP; Value: 1.8K; Footprint Path: Y:\MIS_DATABASE\Library\ALTIUM_TOOL\PCB_FOOTPRINTS\Altium_Footprint_Lib.PcbLib; Library Path: Y:\MIS_DATABASE\Library\ALTIUM_TOOL\SCHEMATICS_PARTS\MS_DISCRETE_Library.schlib; MECHANICAL 3D STEP FILE: RES0402_0-5; Chkd/date: MAZHAR/170709; Crtd /date: MAZHAR/200907; Datasheet: Y:\MIS_DATABASE\DATASHEETS\RESISTORS\MCR10.PDF; Temperature: -55°C+155°C; Weight: 0.57mg; Height: 0.40MM; Library Ref: RESISTOR; Distributor_part_number: RHM1.8KJCT-ND; Distributor_name: DIGIKEY; Wattage: 1/16W; Tolerance: 5%; Footprint Ref: RES0402_0-5; Manufacturer: YAGEO; PCB Footprint: RES0402_0-5
R98 = RESISTOR_Dup2: RES 47.5K 1/16W 1% 0402; Part Reference: R98; Part_type: RESISTORS\FIXED; Mfr_part_number: CRCW040247K5FKED; Mfr_name: VISHAY; Mistral Part No: 110017010006-R; Custom_Duty: 15%; Customs_HS_Code: 85332119; Voltage: NA; Project: TPR12_SVB; Value: 47.5K_1%; Footprint Path: Y:\MIS_DATABASE\Library\ALTIUM_TOOL\PCB_FOOTPRINTS\Altium_Footprint_Lib.PcbLib; Library Path: Y:\MIS_DATABASE\Library\ALTIUM_TOOL\SCHEMATICS_PARTS\MS_DISCRETE_Library.schlib; MECHANICAL 3D STEP FILE: RES0402_0-5; Chkd/date: MANIRAJA/170320; Crtd /date: MANIRAJA/170320; Datasheet: Y:\MIS_DATABASE\DATASHEETS\RESISTORS\CRCW0603.PDF; Temperature: -55°C+155°C; Weight: 0.65mg; Height: 0.40MM; Library Ref: RESISTOR; Distributor_part_number: 541-47.5KLCT-ND; Distributor_name: DIGIKEY; Wattage: 1/16W; Tolerance: 1%; Footprint Ref: RES0402_0-5; Manufacturer: VISHAY; PCB Footprint: RES0402_0-5
R99 = RESISTOR_Dup2: RES 6.19K 1/16W 1% 0402; Part Reference: R99; Mistral Part No: 110022010013-R; Mfr_name: YAGEO AMERICA; Mfr_part_number: RC0402FR-076K19L; Part_type: RESISTORS\FIXED; Project: J7AHP_PROTO_BRD; Voltage: NA; Customs_HS_Code: 85332119; Custom_Duty: 15%; Value: 6.19K_1%; Footprint Ref: RES0402_0-5; Tolerance: 1%; Wattage: 1/16W; Distributor_name: DIGIKEY; Distributor_part_number: 311-6.19KLRCT-ND; Library Ref: RESISTOR; Height: 0.40MM; Weight: 0.65mg; Temperature: -55°C+155°C; Datasheet: Y:\MIS_DATABASE\DATASHEETS\RESISTORS\RCXXXXL-SER_MAR18.PDF; Crtd /date: TAMILARASU/190122; Chkd/date: MANIRAJA/190122; MECHANICAL 3D STEP FILE: RES0402_0-5; Library Path: Y:\MIS_DATABASE\Library\ALTIUM_TOOL\SCHEMATICS_PARTS\MS_DISCRETE_Library.schlib; Footprint Path: Y:\MIS_DATABASE\Library\ALTIUM_TOOL\PCB_FOOTPRINTS\Altium_Footprint_Lib.PcbLib; Manufacturer: YAGEO AMERICA; PCB Footprint: RES0402_0-5
R102 = RESISTOR_Dup2: RES 10K 1/16W 1% 0402; Part Reference: R102; Part_type: RESISTORS\FIXED; Mfr_part_number: RC0402FR-0710KL; Mfr_name: YAGEO AMERICA; Mistral Part No: 110015090015-R; Custom_Duty: 15%; Customs_HS_Code: 85332119; Voltage: NA; Project: VOCERA; Value: 10K_1%; Footprint Path: Y:\MIS_DATABASE\Library\ALTIUM_TOOL\PCB_FOOTPRINTS\Altium_Footprint_Lib.PcbLib; Library Path: Y:\MIS_DATABASE\Library\ALTIUM_TOOL\SCHEMATICS_PARTS\MS_DISCRETE_Library.schlib; MECHANICAL 3D STEP FILE: RES0402_0-5; Chkd/date: VASANTHA/201216; Crtd /date: GEETHA/290506; Datasheet: Y:\MIS_DATABASE\DATASHEETS\RESISTORS\RCXXXXL-SER_MAR18.PDF; Temperature: -55°C+155°C; Weight: 0.65mg; Height: 0.40MM; Library Ref: RESISTOR; Distributor_part_number: 311-10.0KLRTR-ND; Distributor_name: DIGIKEY; Wattage: 1/16W; Tolerance: 1%; Footprint Ref: RES0402_0-5; Manufacturer: YAGEO AMERICA; PCB Footprint: RES0402_0-5
TP29 = TESTPOINT_Dup1: TESTPOINT CIR 30 SMD; Part Reference: TP29; Mistral Part No: 130009030930; Mfr_name: LOCAL; Project: BT MODULE_CSRBC04; Tolerance: NA; Value: TP30_SMD; Footprint Ref: TP30_SMD; Mfr_part_number: TP30_SMD; Part_type: TESTPOINT; Voltage: NA; Wattage: NA; Package: SMD; Distributor_name: NA; Distributor_part_number: NA; Library Ref: TESTPOINT; Height: NA; Weight: NA; Temperature: NA; Datasheet: NA; Crtd /date: MAZHAR/171006; Chkd/date: SHREESHAIL/171006; RoHS: NA; Customs_HS_Code: NA; Custom_Duty: NA; MECHANICAL 3D STEP FILE: NA; Library Path: Y:\MIS_DATABASE\Library\ALTIUM_TOOL\SCHEMATICS_PARTS\MS_DISCRETE_Library.schlib; Footprint Path: Y:\MIS_DATABASE\Library\ALTIUM_TOOL\PCB_FOOTPRINTS\Altium_Footprint_Lib.PcbLib; Manufacturer: LOCAL; PCB Footprint: TP30_SMD
U16 = TPS62872-Q1_VQFN16: IC 2.7-6V INPUT 15A STACKABLE FAST TRANSIENT SYNCHRONOUS STEP-DOWN DC-DC CONVERTER VQFN16; Part Reference: U16; Part_type: ICS\POWER\DC-DC CONVERTER; Mfr_name: TEXAS INSTRUMENTS; Mistral Part No: 142022030022; Custom_Duty: 15%; Customs_HS_Code: 85423100; Wattage: NA; Project: TI_J7AHP_EVM_BRD; Remarks: CREATED SAME AS  TPS62873QWRXSR-Q1; Value: TPS62873Y1QWRXSRQ1; Footprint Path: Y:\MIS_DATABASE\Library\ALTIUM_TOOL\PCB_FOOTPRINTS\Altium_Footprint_Lib.PcbLib; Library Path: Y:\MIS_DATABASE\Library\ALTIUM_TOOL\SCHEMATICS_PARTS\MS_MISCPOWER_Library.schlib; MECHANICAL 3D STEP FILE: VQFN16_TPS62872-Q1_100X140_1-1; RoHS: NA; Chkd/date: ALVY/280322; Crtd /date: ALVY/280322; Datasheet: Y:\MIS_DATABASE\DATASHEETS\ICS\POWER\TPS6287X-Q1.PDF; Temperature: -40°C+150°C; Weight: NA; Height: 1.05MM; Library Ref: TPS62872-Q1_VQFN16; Distributor_part_number: NA; Distributor_name: NA; Package: VQFN16; Voltage: NA; Tolerance: NA; Mfr_part_number: TPS62873Y1QWRXSRQ1; Footprint Ref: VQFN16_TPS62872-Q1_100X140_1-1; Manufacturer: TEXAS INSTRUMENTS; PCB Footprint: VQFN16_TPS62872-Q1_100X140_1-1
U19 = TPS62872-Q1_VQFN16: IC 2.7-6V INPUT 15A STACKABLE FAST TRANSIENT SYNCHRONOUS STEP-DOWN DC-DC CONVERTER VQFN16; Part Reference: U19; Part_type: ICS\POWER\DC-DC CONVERTER; Mfr_name: TEXAS INSTRUMENTS; Mistral Part No: 142022030022; Custom_Duty: 15%; Customs_HS_Code: 85423100; Wattage: NA; Project: TI_J7AHP_EVM_BRD; Remarks: CREATED SAME AS  TPS62873QWRXSR-Q1; Value: TPS62873Y1QWRXSRQ1; Footprint Path: Y:\MIS_DATABASE\Library\ALTIUM_TOOL\PCB_FOOTPRINTS\Altium_Footprint_Lib.PcbLib; Library Path: Y:\MIS_DATABASE\Library\ALTIUM_TOOL\SCHEMATICS_PARTS\MS_MISCPOWER_Library.schlib; MECHANICAL 3D STEP FILE: VQFN16_TPS62872-Q1_100X140_1-1; RoHS: NA; Chkd/date: ALVY/280322; Crtd /date: ALVY/280322; Datasheet: Y:\MIS_DATABASE\DATASHEETS\ICS\POWER\TPS6287X-Q1.PDF; Temperature: -40°C+150°C; Weight: NA; Height: 1.05MM; Library Ref: TPS62872-Q1_VQFN16; Distributor_part_number: NA; Distributor_name: NA; Package: VQFN16; Voltage: NA; Tolerance: NA; Mfr_part_number: TPS62873Y1QWRXSRQ1; Footprint Ref: VQFN16_TPS62872-Q1_100X140_1-1; Manufacturer: TEXAS INSTRUMENTS; PCB Footprint: VQFN16_TPS62872-Q1_100X140_1-1

## Sheet 55. SOC PMIC.SchDoc: PMIC
size 513 x 386 mm; Project: PROC154E2(001)_SK_AM69; Issue: 1.0; RevCode: E3; Page Create Date: March  8, 1995; Variant Name: Core Design; Schematic Page Number: 55; Page Number: 55; Page Size: C; Comment: MISTRAL_TITLEBLK_CSIZE_1; Page Count: 62; Schematic Page Count: 62; Name: PROC154E2 001 SK AM69; DsnPath: C:\Users\danie\Downloads\sprr466c\PROC154E3_RP\PROC154E3_SCH.DSN; SchematicName: SCHEMATIC1; PageName: 55. SOC PMIC; PageSize: C; TopSchematic: True
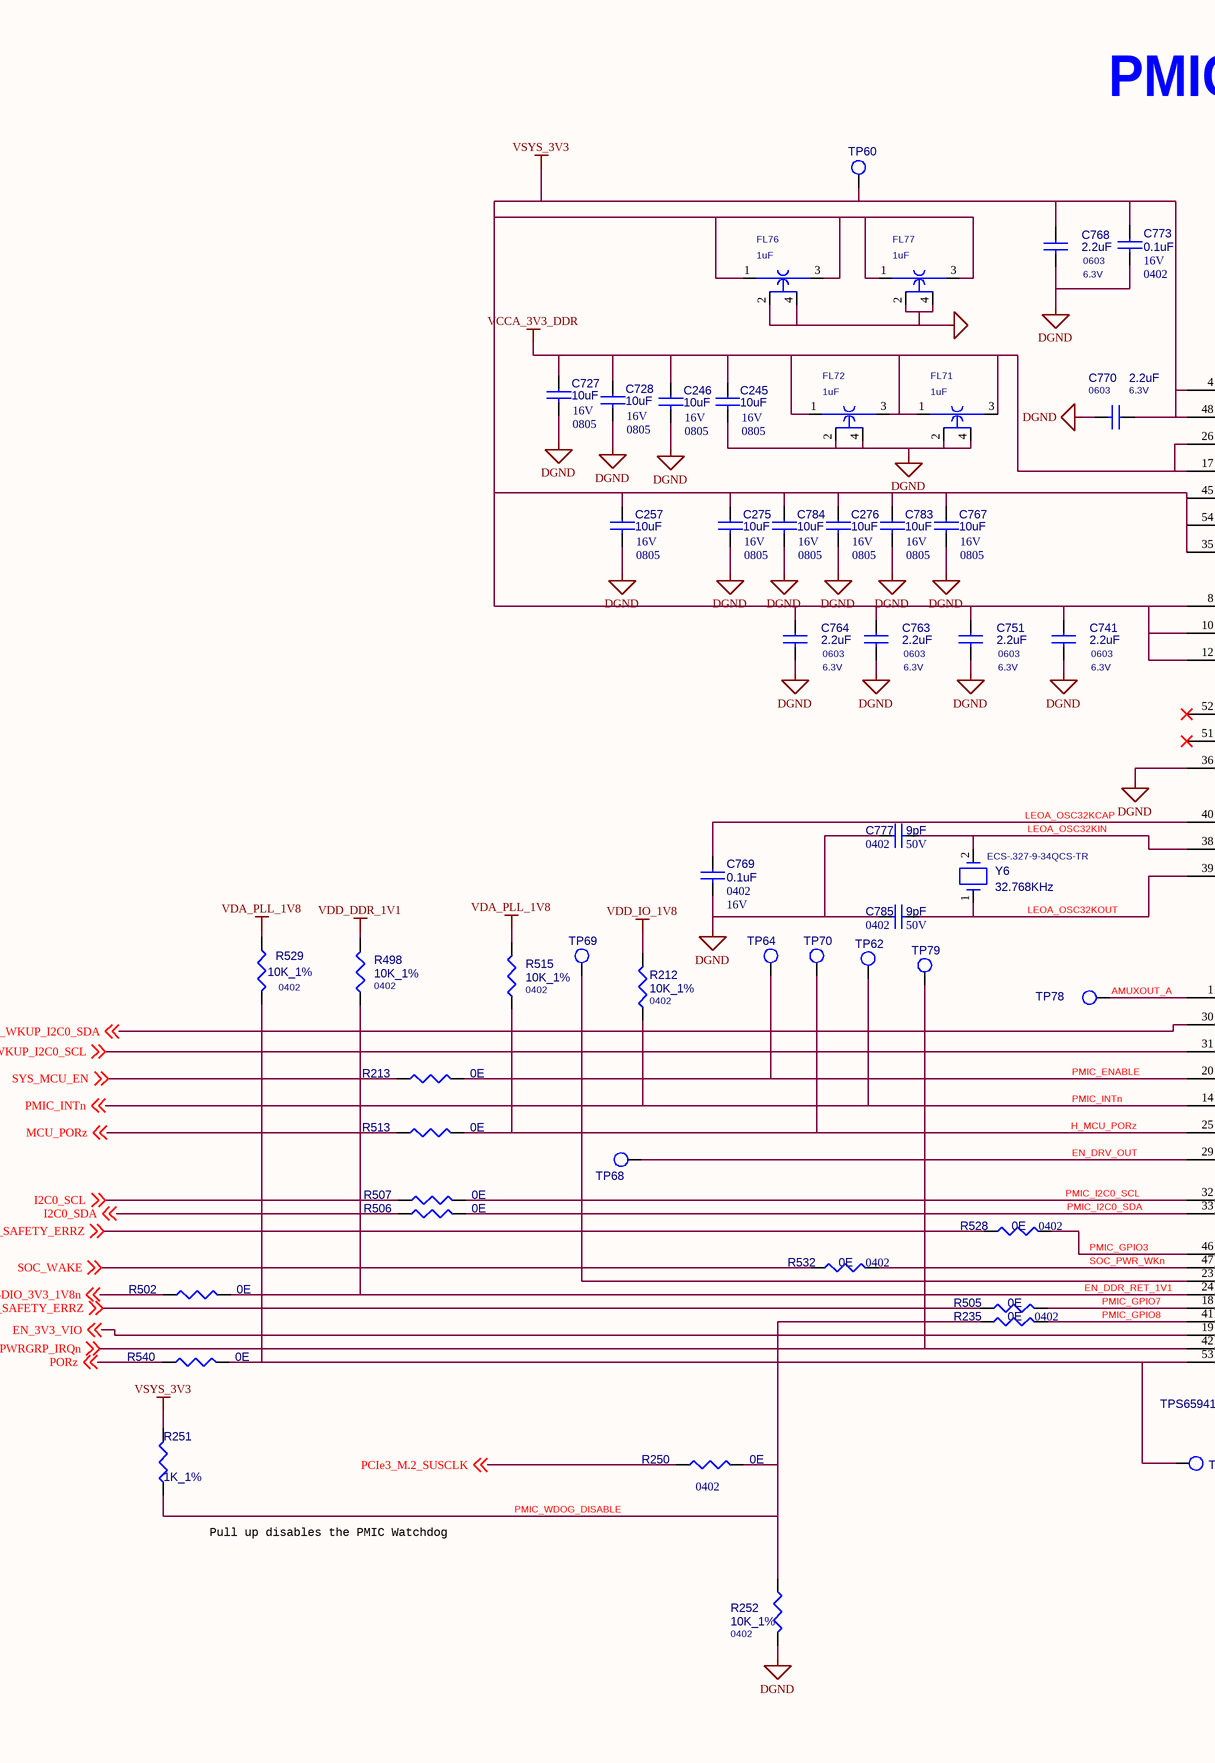
[diagram p92: 55. SOC PMIC.SchDoc, left]
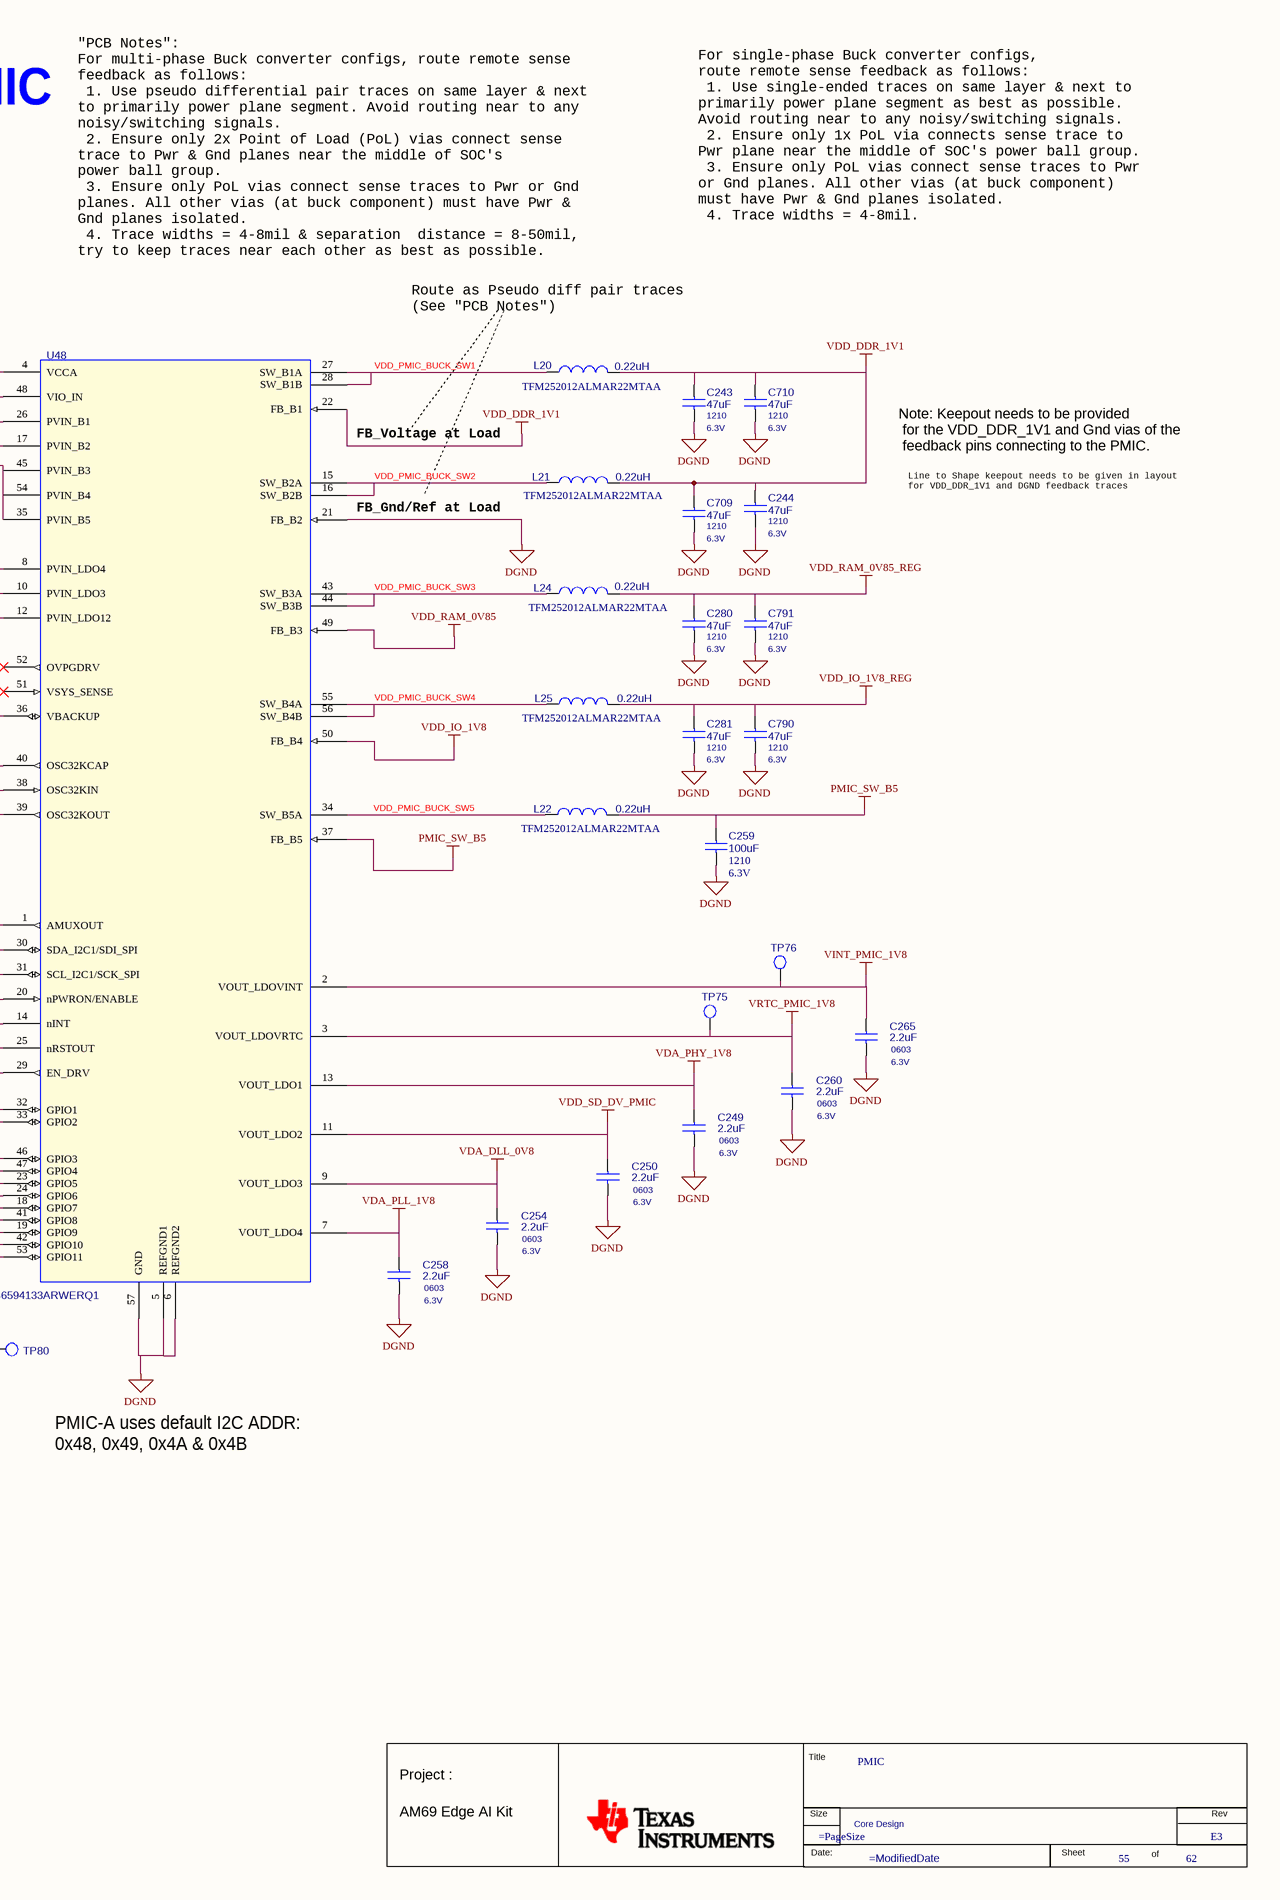
[diagram p93: 55. SOC PMIC.SchDoc, right]

### Parts
(Parts that share a designator on the sheet are numbered #1, #2 ... from top to bottom, then left to right.)
*#55  RevCode: E3  Title: PMIC  Page Number: 55  Page Count: 62  Variant Name: Core Design  (hidden comment: MISTRAL_TITLEBLK_CSIZE_1)  (graphical)
C243  47uF  Voltage: 6.3V  Package: 1210  [CAP1210_2-75]
C244  47uF  Voltage: 6.3V  Package: 1210  [CAP1210_2-75]
C245  10uF  Package: 0805  Voltage: 16V  [CAP0805_1-5]
C246  10uF  Package: 0805  Voltage: 16V  [CAP0805_1-5]
C249  2.2uF  Package: 0603  Voltage: 6.3V  [CAP0603_1]
C250  2.2uF  Package: 0603  Voltage: 6.3V  [CAP0603_1]
C254  2.2uF  Package: 0603  Voltage: 6.3V  [CAP0603_1]
C257  10uF  Package: 0805  Voltage: 16V  [CAP0805_1-5]
C258  2.2uF  Package: 0603  Voltage: 6.3V  [CAP0603_1]
C259  100uF  Package: 1210  Voltage: 6.3V  [CAP1210_2-75]
C260  2.2uF  Package: 0603  Voltage: 6.3V  [CAP0603_1]
C265  2.2uF  Package: 0603  Voltage: 6.3V  [CAP0603_1]
C275  10uF  Package: 0805  Voltage: 16V  [CAP0805_1-5]
C276  10uF  Voltage: 16V  Package: 0805  [CAP0805_1-5]
C280  47uF  Voltage: 6.3V  Package: 1210  [CAP1210_2-75]
C281  47uF  Voltage: 6.3V  Package: 1210  [CAP1210_2-75]
C709  47uF  Package: 1210  Voltage: 6.3V  [CAP1210_2-75]
C710  47uF  Voltage: 6.3V  Package: 1210  [CAP1210_2-75]
C727  10uF  Voltage: 16V  Package: 0805  [CAP0805_1-5]
C728  10uF  Package: 0805  Voltage: 16V  [CAP0805_1-5]
C741  2.2uF  Package: 0603  Voltage: 6.3V  [CAP0603_1]
C751  2.2uF  Voltage: 6.3V  Package: 0603  [CAP0603_1]
C763  2.2uF  Voltage: 6.3V  Package: 0603  [CAP0603_1]
C764  2.2uF  Package: 0603  Voltage: 6.3V  [CAP0603_1]
C767  10uF  Voltage: 16V  Package: 0805  [CAP0805_1-5]
C768  2.2uF  Voltage: 6.3V  Package: 0603  [CAP0603_1]
C769  0.1uF  Voltage: 16V  Package: 0402  [CAP0402_0-75]
C770  2.2uF  Voltage: 6.3V  Package: 0603  [CAP0603_1]
C773  0.1uF  Package: 0402  Voltage: 16V  [CAP0402_0-75]
C777  9pF  Package: 0402  Voltage: 50V  [CAP0402_0-75]
C783  10uF  Package: 0805  Voltage: 16V  [CAP0805_1-5]
C784  10uF  Voltage: 16V  Package: 0805  [CAP0805_1-5]
C785  9pF  Package: 0402  Voltage: 50V  [CAP0402_0-75]
C790  47uF  Voltage: 6.3V  Package: 1210  [CAP1210_2-75]
C791  47uF  Voltage: 6.3V  Package: 1210  [CAP1210_2-75]
FL71  1uF  [EMIFIL_NFM15CC_0402_0-5_TI]
FL72  1uF  [EMIFIL_NFM15CC_0402_0-5_TI]
FL76  1uF  [EMIFIL_NFM15CC_0402_0-5_TI]
FL77  1uF  [EMIFIL_NFM15CC_0402_0-5_TI]
L20  0.22uH  Mfr_part_number: TFM252012ALMAR22MTAA  [IND1008_1-2]
L21  0.22uH  Mfr_part_number: TFM252012ALMAR22MTAA  [IND1008_1-2]
L22  0.22uH  Mfr_part_number: TFM252012ALMAR22MTAA  [IND1008_1-2]
L24  0.22uH  Mfr_part_number: TFM252012ALMAR22MTAA  [IND1008_1-2]
L25  0.22uH  Mfr_part_number: TFM252012ALMAR22MTAA  [IND1008_1-2]
R212  10K_1%  Package: 0402  [RES0402_0-5]
R213  0E  [RES0402_0-5]
R235  0E  Package: 0402  [RES0402_0-5]
R250  0E  Package: 0402  [RES0402_0-5]
R251  1K_1%  [RES0402_0-5]
R252  10K_1%  Package: 0402  [RES0402_0-5]
R498  10K_1%  Package: 0402  [RES0402_0-5]
R502  0E  [RES0402_0-5]
R505  0E  [RES0402_0-5]
R506  0E  [RES0402_0-5]
R507  0E  [RES0402_0-5]
R513  0E  [RES0402_0-5]
R515  10K_1%  Package: 0402  [RES0402_0-5]
R528  0E  Package: 0402  [RES0402_0-5]
R529  10K_1%  Package: 0402  [RES0402_0-5]
R532  0E  Package: 0402  [RES0402_0-5]
R540  0E  [RES0402_0-5]
TP60  TP30_SMD  [TP30_SMD]  (value not drawn)
TP62  TP30_SMD  [TP30_SMD]  (value not drawn)
TP64  TP30_SMD  [TP30_SMD]  (value not drawn)
TP68  TP30_SMD  [TP30_SMD]  (value not drawn)
TP69  TP30_SMD  [TP30_SMD]  (value not drawn)
TP70  TP30_SMD  [TP30_SMD]  (value not drawn)
TP75  TP30_SMD  [TP30_SMD]  (value not drawn)
TP76  TP30_SMD  [TP30_SMD]  (value not drawn)
TP78  TP30_SMD  [TP30_SMD]  (value not drawn)
TP79  TP30_SMD  [TP30_SMD]  (value not drawn)
TP80  TP30_SMD  [TP30_SMD]  (value not drawn)
U48  TPS6594133ARWERQ1  [RVJ0056A]
Y6  32.768KHz  Mfr_part_number: ECS-.327-9-34QCS-TR  [XTAL_ECS-32_130X60_SMD_0-9]

### Nets
DGND: C243.2 C244.2 C245.2 C246.2 C249.2 C250.2 C254.2 C257.2 C258.2 C259.2 C260.2 C265.2 C275.2 C276.2 C280.2 C281.2 C709.2 C710.2 C727.2 C728.2 C741.2 C751.2 C763.2 C764.2 C767.2 C768.2 C769.2 C770.2 C773.2 C777.1 C783.2 C784.2 C785.1 C790.2 C791.2 FL71.2 FL71.4 FL72.2 FL72.4 FL76.2 FL76.4 FL77.2 FL77.4 R252.1 U48.5(REFGND1) U48.6(REFGND2) U48.21(FB_B2) U48.36(VBACKUP) U48.57(GND)  [project net VDD_CPU_HCPS_GOSNS]
PMIC_SW_B5: C259.1 L22.2 U48.37(FB_B5)
VCCA_3V3_DDR: C245.1 C246.1 C727.1 C728.1 FL71.1 FL71.3 FL72.1 FL72.3 U48.17(PVIN_B2) U48.26(PVIN_B1)
VDA_DLL_0V8: C254.1 U48.9(VOUT_LDO3)
VDA_PHY_1V8: C249.1 U48.13(VOUT_LDO1)
VDA_PLL_1V8: C258.1 R515.2 R529.2 U48.7(VOUT_LDO4)  [project net VDA_MCU_1V8]
VDD_DDR_1V1: C243.1 C244.1 C709.1 C710.1 L20.2 L21.2 R498.2 U48.22(FB_B1)
VDD_IO_1V8: R212.2 U48.50(FB_B4)
VDD_IO_1V8_REG: C281.1 C790.1 L25.2
VDD_RAM_0V85: U48.49(FB_B3)
VDD_RAM_0V85_REG: C280.1 C791.1 L24.2
VDD_SD_DV_PMIC: C250.1 U48.11(VOUT_LDO2)
VINT_PMIC_1V8: C265.1 TP76.1(TP) U48.2(VOUT_LDOVINT)
VRTC_PMIC_1V8: C260.1 TP75.1(TP) U48.3(VOUT_LDOVRTC)
VSYS_3V3: C257.1 C275.1 C276.1 C741.1 C751.1 C763.1 C764.1 C767.1 C768.1 C770.1 C773.1 C783.1 C784.1 FL76.1 FL76.3 FL77.1 FL77.3 R251.2 TP60.1(TP) U48.4(VCCA) U48.8(PVIN_LDO4) U48.10(PVIN_LDO3) U48.12(PVIN_LDO12) U48.35(PVIN_B5) U48.45(PVIN_B3) U48.48(VIO_IN) U48.54(PVIN_B4)  [project net V_3V3]
AMUXOUT_A: TP78.1(TP) U48.1(AMUXOUT)
EN_3V3_VIO: U48.19(GPIO9) ; off-sheet EN_3V3_VIO
EN_DDR_RET_1V1: R498.1 R502.1 U48.24(GPIO6)
EN_DRV_OUT: TP68.1(TP) U48.29(EN_DRV)
H_MCU_PORz: R513.1 R515.1 TP70.1(TP) U48.25(nRSTOUT)
H_WKUP_I2C0_SCL: U48.31(SCL_I2C1/SCK_SPI) ; off-sheet H_WKUP_I2C0_SCL
H_WKUP_I2C0_SDA: U48.30(SDA_I2C1/SDI_SPI) ; off-sheet H_WKUP_I2C0_SDA
I2C0_SCL: R507.2 ; off-sheet I2C0_SCL
I2C0_SDA: R506.2 ; off-sheet I2C0_SDA
LEOA_OSC32KCAP: C769.1 U48.40(OSC32KCAP)
LEOA_OSC32KIN: C777.2 U48.38(OSC32KIN) Y6.2
LEOA_OSC32KOUT: C785.2 U48.39(OSC32KOUT) Y6.1
MCU_PORZ: R513.2 R540.2 ; off-sheet MCU_PORz, off-sheet PORz  [also labelled PORz]
MCU_SAFETY_ERRZ: R505.1 ; off-sheet MCU_SAFETY_ERRZ
PCIe3_M.2_SUSCLK: R250.2 ; off-sheet PCIe3_M.2_SUSCLK
PMIC_ENABLE: R213.1 TP64.1(TP) U48.20(nPWRON/ENABLE)
PMIC_GPIO3: R528.2 U48.46(GPIO3)
PMIC_GPIO7: R505.2 U48.18(GPIO7)
PMIC_GPIO8: R235.2 U48.41(GPIO8)
PMIC_I2C0_SCL: R507.1 U48.32(GPIO1)
PMIC_I2C0_SDA: R506.1 U48.33(GPIO2)
PMIC_INTn: R212.1 TP62.1(TP) U48.14(nINT) ; off-sheet PMIC_INTn
PMIC_WDOG_DISABLE: R235.1 R250.1 R251.1 R252.2
SEL_SDIO_3V3_1V8n: R502.2 ; off-sheet SEL_SDIO_3V3_1V8n
SOC_PWR_WKn: R532.2 U48.47(GPIO4)
SOC_PWRGRP_IRQn: TP79.1(TP) U48.42(GPIO10) ; off-sheet SOC_PWRGRP_IRQn
SOC_SAFETY_ERRZ: R528.1 ; off-sheet SOC_SAFETY_ERRZ
SOC_WAKE: R532.1 ; off-sheet SOC_WAKE
SYS_MCU_EN: R213.2 ; off-sheet SYS_MCU_EN
VDD_PMIC_BUCK_SW1: L20.1 U48.27(SW_B1A) U48.28(SW_B1B)
VDD_PMIC_BUCK_SW2: L21.1 U48.15(SW_B2A) U48.16(SW_B2B)
VDD_PMIC_BUCK_SW3: L24.1 U48.43(SW_B3A) U48.44(SW_B3B)
VDD_PMIC_BUCK_SW4: L25.1 U48.55(SW_B4A) U48.56(SW_B4B)
VDD_PMIC_BUCK_SW5: L22.1 U48.34(SW_B5A)
NetR529_1: R529.1 R540.1 TP80.1(TP) U48.53(GPIO11)
NetTP69_1: TP69.1(TP) U48.23(GPIO5)

Not connected (* = marked no-connect by the designer): U48 51(VSYS_SENSE)* 52(OVPGDRV)*

### Notes on the sheet
- "PCB Notes":
  For multi-phase Buck converter configs, route remote sense
  feedback as follows:
  1. Use pseudo differential pair traces on same layer & next
  to primarily power plane segment. Avoid routing near to any
  noisy/switching signals.
  2. Ensure only 2x Point of Load (PoL) vias connect sense
  trace to Pwr & Gnd planes near the middle of SOC's
  power ball group.
  3. Ensure only PoL vias connect sense traces to Pwr or Gnd
  planes. All other vias (at buck component) must have Pwr &
  Gnd planes isolated.
  4. Trace widths = 4-8mil & separation  distance = 8-50mil,
  try to keep traces near each other as best as possible.
- For single-phase Buck converter configs,
  route remote sense feedback as follows:
  1. Use single-ended traces on same layer & next to
  primarily power plane segment as best as possible.
  Avoid routing near to any noisy/switching signals.
  2. Ensure only 1x PoL via connects sense trace to
  Pwr plane near the middle of SOC's power ball group.
  3. Ensure only PoL vias connect sense traces to Pwr
  or Gnd planes. All other vias (at buck component)
  must have Pwr & Gnd planes isolated.
  4. Trace widths = 4-8mil.
- PMIC
- Route as Pseudo diff pair traces
  (See "PCB Notes")
- Note: Keepout needs to be provided
  for the VDD_DDR_1V1 and Gnd vias of the
  feedback pins connecting to the PMIC.
- (near U48) FB_Voltage at Load
- Line to Shape keepout needs to be given in layout
  for VDD_DDR_1V1 and DGND feedback traces
- (near U48) FB_Gnd/Ref at Load
- PMIC-A uses default I2C ADDR:
  0x48, 0x49, 0x4A & 0x4B
- Pull up disables the PMIC Watchdog
- (in symbol MISTRAL_TITLEBLK_CSIZE_1) Title; Project :; Size; Rev; AM69 Edge AI Kit; Date:; Sheet; of